# Altium schematic sheet GSM Module.SchDoc
size A3; SheetNumber: 2; SheetTotal: 6
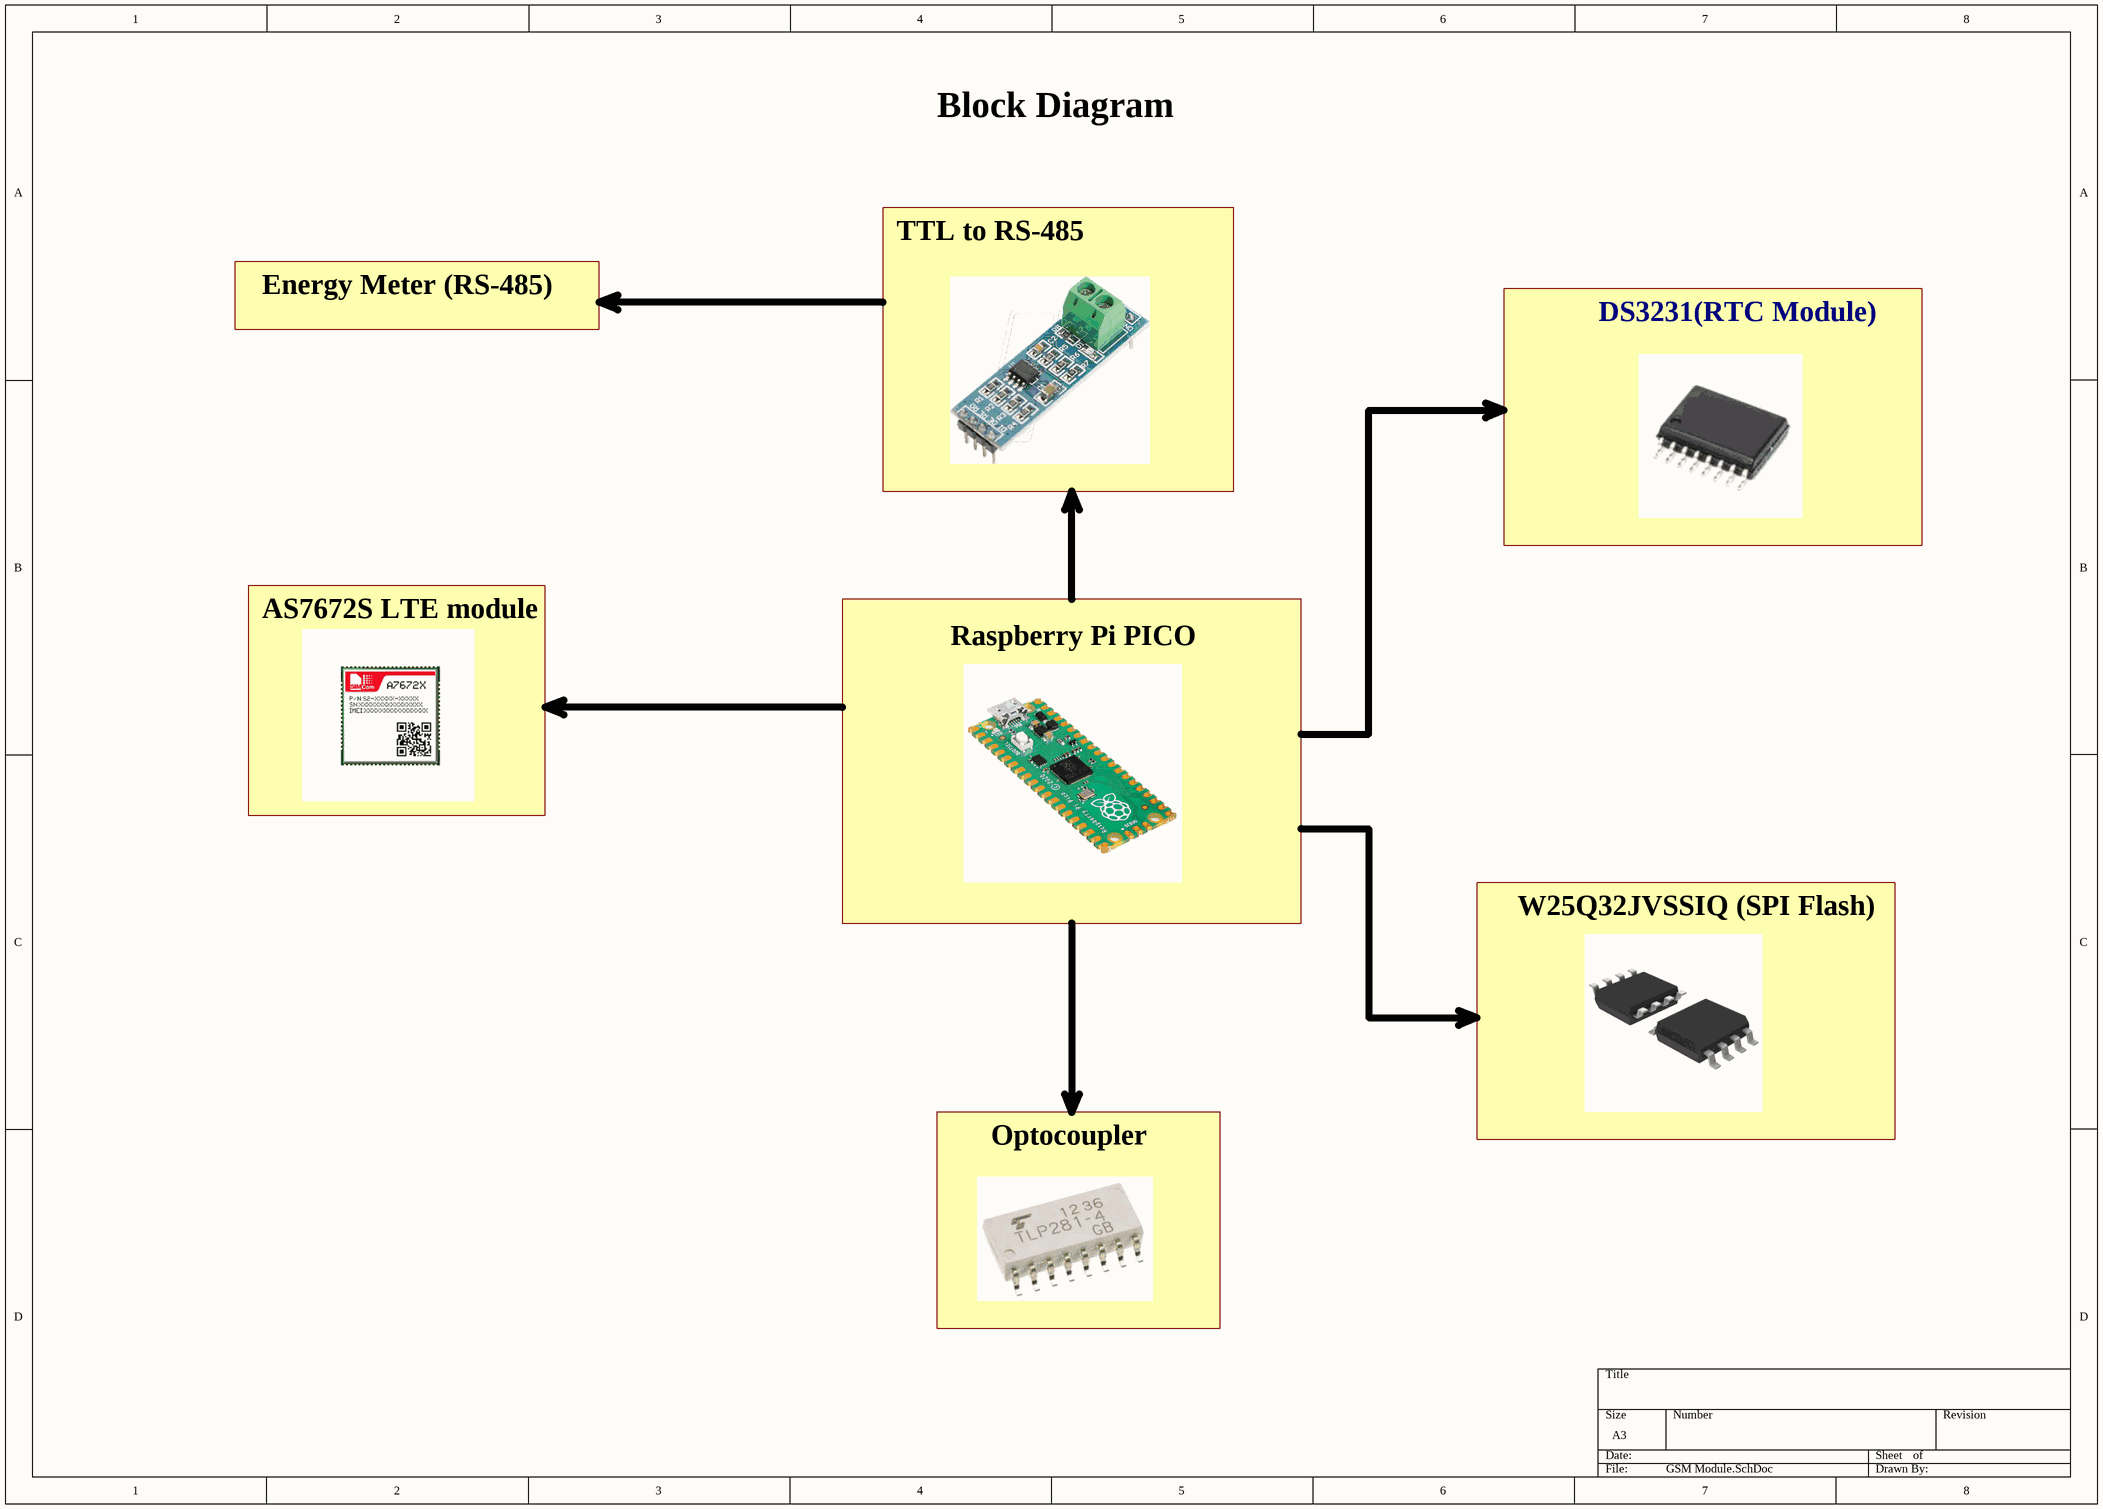
[diagram p0: GSM Module.SchDoc]

## Notes on the sheet
- Block Diagram
- TTL to RS-485
- Energy Meter (RS-485)
- DS3231(RTC Module)
- AS7672S LTE module
- Raspberry Pi PICO
- W25Q32JVSSIQ (SPI Flash)
- Optocoupler